# EAGLE design mini system- 5 components vertical (EAGLE 9.2.2)
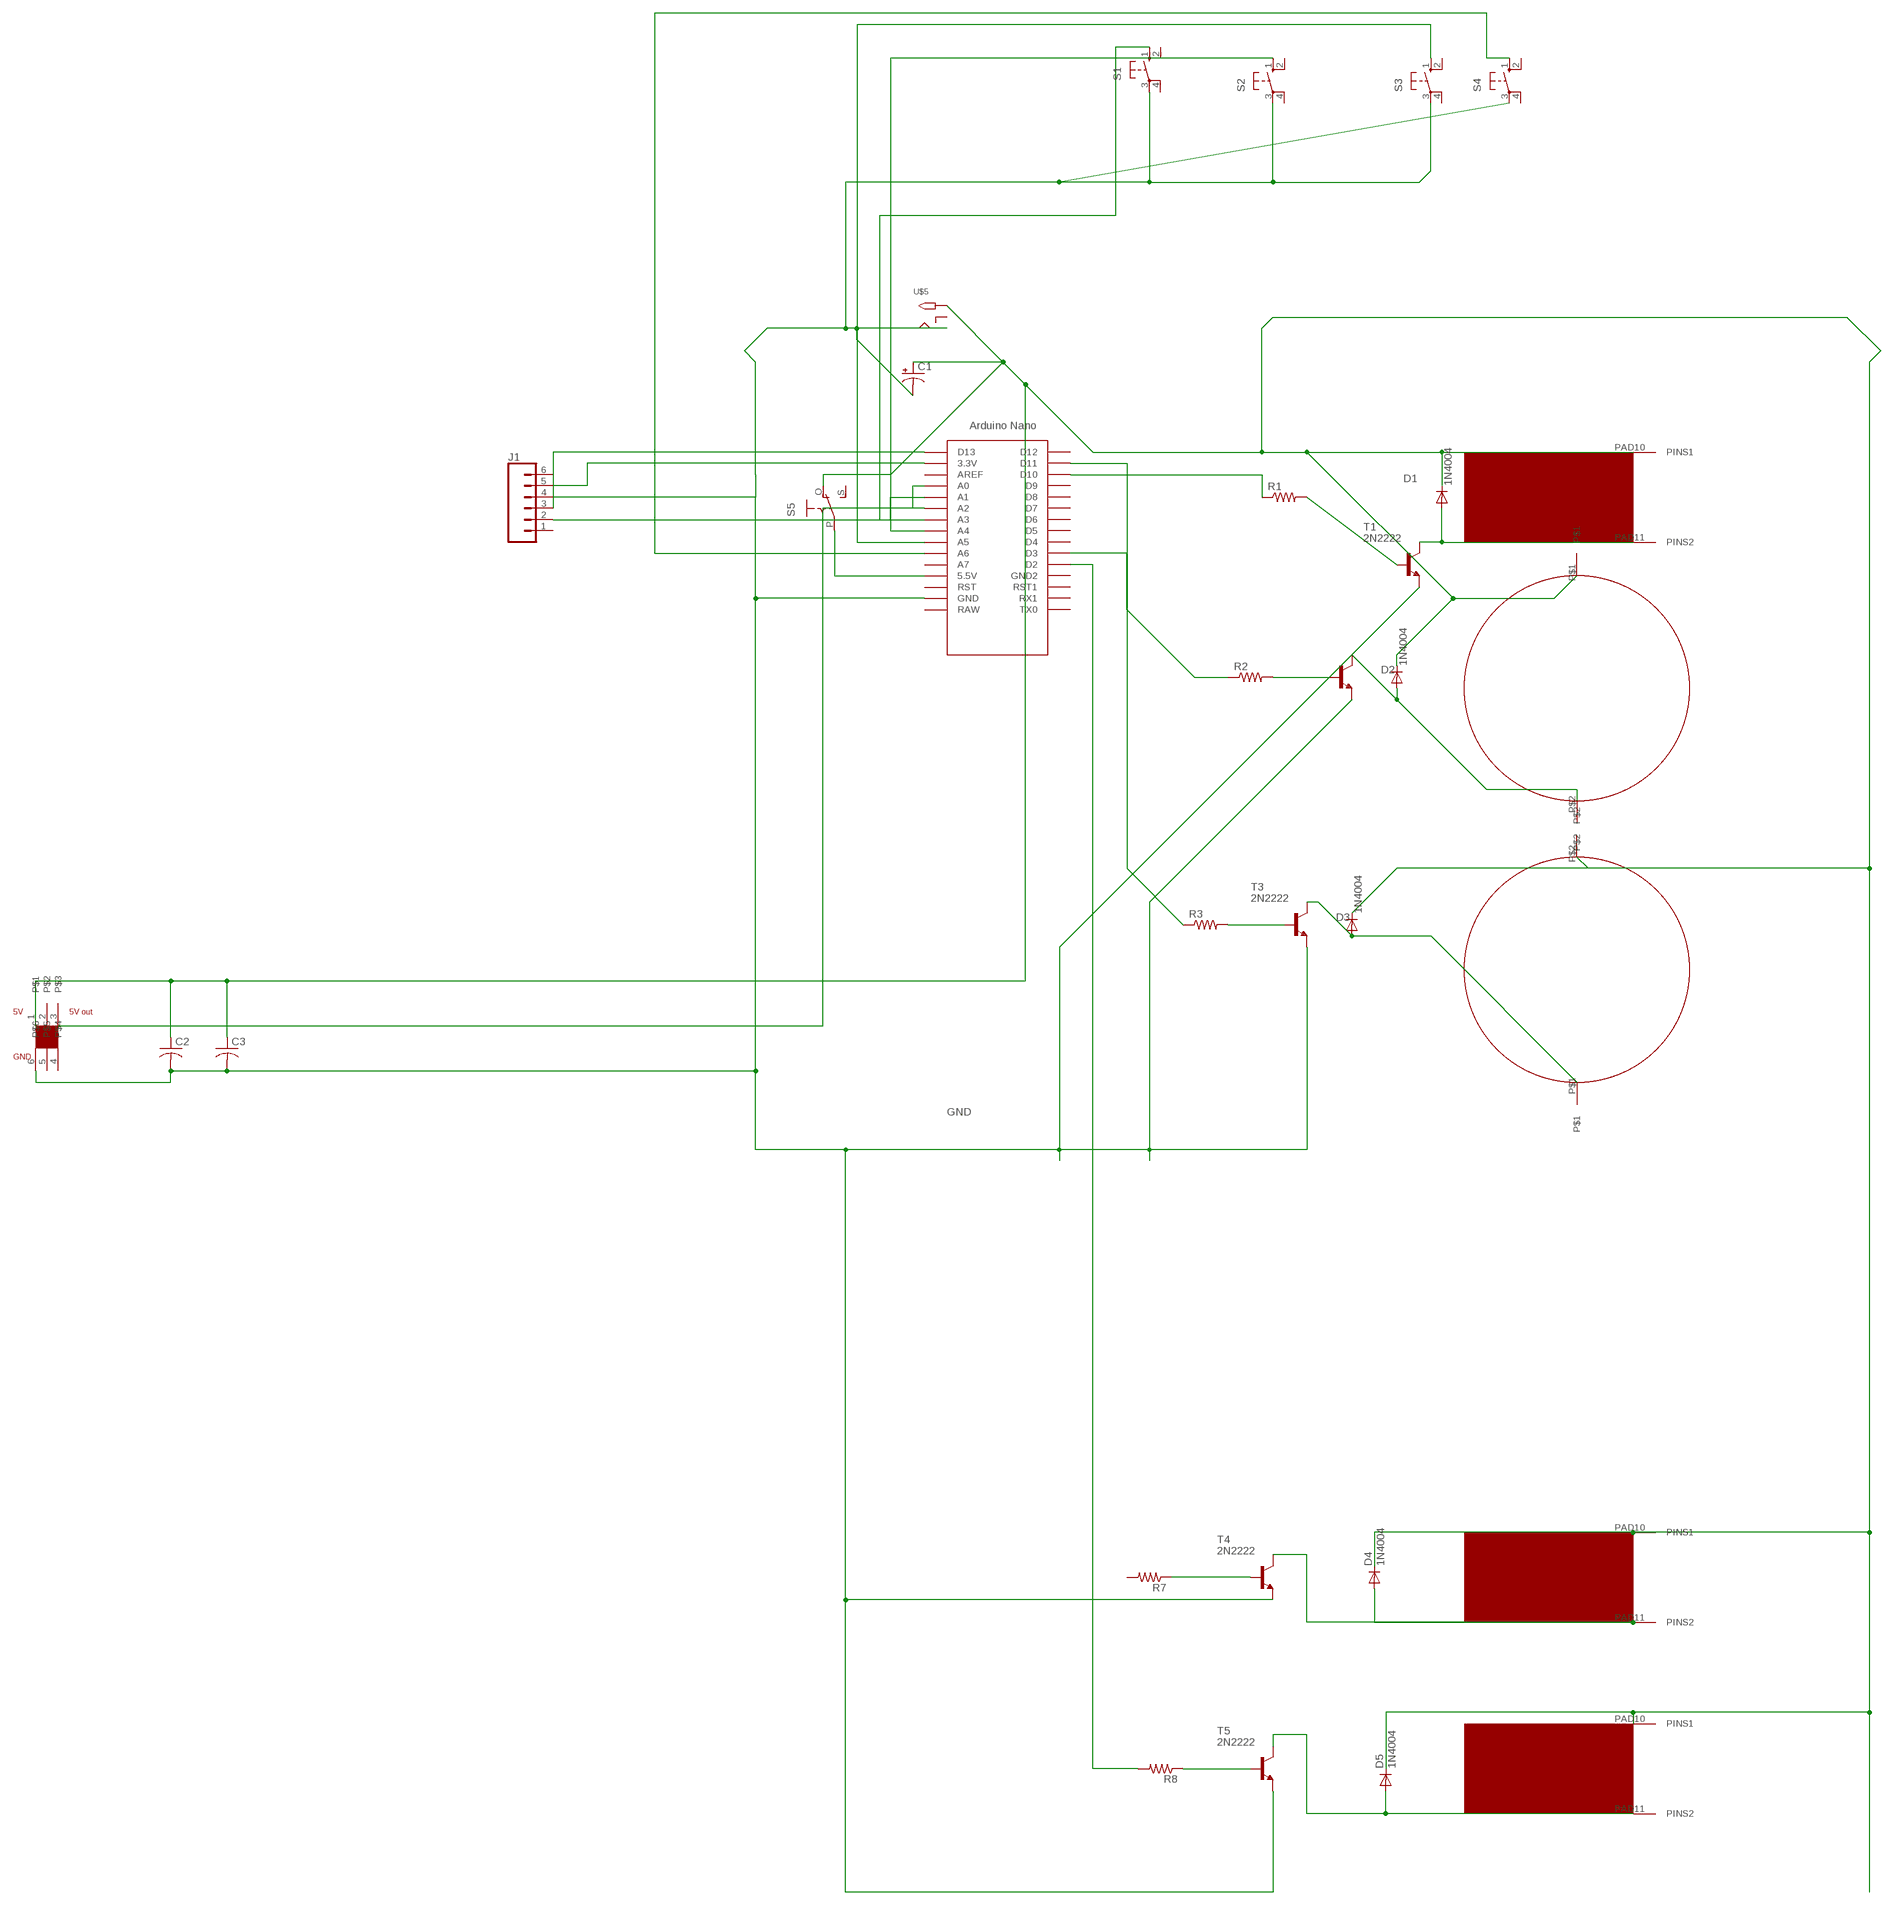
[diagram p0: schematic, sheet 1]

## Parts
C1  CPOL-USE2.5-5  [E2,5-5]
C2  C-US025-024X044  [C025-024X044]
C3  C-US025-024X044  [C025-024X044]
D1  1N4004  [DO41-10]
D2  1N4004  [DO41-10]
D3  1N4004  [DO41-10]
D4  1N4004  [DO41-10]
D5  1N4004  [DO41-10]
J1  CONN_06SILK_FEMALE_PTH  [1X06]
PUMP1  DCPUMP  [PUMP]
R1  R-US_0207/10  [0207/10]
R2  R-US_0207/10  [0207/10]
R3  R-US_0207/10  [0207/10]
R7  R-US_0207/10  [0207/10]
R8  R-US_0207/10  [0207/10]
S1  10-XX  [B3F-10XX]
S2  10-XX  [B3F-10XX]
S3  10-XX  [B3F-10XX]
S4  10-XX  [B3F-10XX]
S5  EG1218S  [EG1218]
T1  2N2222  [TO92-EBC-OVAL]
T2  2N2222  [TO92-EBC-OVAL]
T3  2N2222  [TO92-EBC-OVAL]
T4  2N2222  [TO92-EBC-OVAL]
T5  2N2222  [TO92-EBC-OVAL]
U$1  NANO  [NANO]
U$2  VALVE  [VALVTEST2]
U$3  VALVE  [VALVTEST2]
U$4  DCPUMP  [PUMP]
U$5  2.1MMJACKTHM  [PJ-102A]
U$6  VALVE  [VALVTEST2]
U$7  ADP5101  [DIP750W53P254L720H850Q6B]

## Nets
5V: C1.+ C2.1 C3.1 D1.C D2.C D3.C D4.C D5.C PUMP1.P$1 S5.O U$2.PAD10(PINS1) U$3.PAD10(PINS1) U$4.P$2 U$5.TIP U$6.PAD10(PINS1) U$7.1
GND: C1.- C2.2 C3.2 J1.4 S1.3(P) S2.3(P) S3.3(P) S4.3(P) T1.E T2.E T3.E T4.E T5.E U$1.GND U$5.RING U$7.6
N$1: R1.2 T1.B
N$2: R2.2 T2.B
N$3: R3.2 T3.B
N$4: R1.1 U$1.D10
N$5: D2.A PUMP1.P$2 T2.C
N$6: R3.1 U$1.D11
N$7: R2.1 U$1.D3
N$8: D1.A T1.C U$2.PAD11(PINS2)
N$9: D3.A T3.C U$4.P$1
N$10: R8.2 U$1.D2
N$11: S1.1(S) U$1.A3
N$12: J1.5 U$1.3.3V
N$13: U$1.A0
N$14: S5.P U$1.5V(5.5V)
N$15: J1.2 U$1.A1
N$16: D4.A T4.C U$3.PAD11(PINS2)
N$17: R7.1 T4.B
N$20: R8.1 T5.B
N$21: D5.A T5.C U$6.PAD11(PINS2)
N$22: U$1.A2 U$7.3
N$23: S2.1(S) U$1.A4
N$24: S4.1(S) U$1.A6
N$25: S3.1(S) U$1.A5
N$26: J1.3 U$1.D13
Unconnected: J1.1 J1.6 R7.2 S1.2(S1) S1.4(P1) S2.2(S1) S2.4(P1) S3.2(S1) S3.4(P1) S4.2(S1) S4.4(P1) S5.S U$1.A7 U$1.AREF U$1.D4 U$1.D5 U$1.D6 U$1.D7 U$1.D8 U$1.D9 U$1.D12 U$1.GND1(GND2) U$1.RAW U$1.RST U$1.RST1 U$1.RX1 U$1.TX0 U$5.RING_SW U$7.2 U$7.4 U$7.5

## Library data of the parts
C1 = adafruit:CPOL-US: POLARIZED CAPACITOR, American symbol
C2 C3 = rcl:C-US: CAPACITOR, American symbol; SPICEPREFIX: C
D1-D5 = adafruit:1N4004: DIODE General purpose 1N400x type rectifier (With bigger pads) http://www.ladyada.net/library/pcb/eaglelibrary.html
J1 = SparkFun-Connectors:CONN_06: Multi connection point. Often used as Generic Header-pin footprint for 0.1 inch spaced/style header connections On any of the 0.1 inch spaced packages, you can populate with these: Break Away Headers - Straight <https://www.sparkfun.com/products/116> (PRT-00116) Break Away Male Headers - Right Angle <https://www.sparkfun.com/products/553> (PRT-00553) Female Headers <https://www.sparkfun.com/products/115> (PRT-00115) Break Away Headers - Machine Pin <https://www.sparkfun.com/products/117> (PRT-00117) Break Away Female Headers - Swiss Machine Pin <https://www.sparkfun.com/products/743> (PRT-00743) Arduino Stackable Header - 6 Pin <https://www.sparkfun.com/products/9280> (PRT-09280) For SCREWTERMINALS and SPRING TERMINALS visit here: Screw Terimnals on SparkFun.com <https://www.sparkfun.com/search/results?term=Screw+Terminals> (5mm/3.5mm/2.54mm spacing) This device is also useful as a general connection point to wire up your design to another part of your project. Our various solder wires solder well into these plated through hole pads. Hook-Up Wire - Assortment (Stranded, 22 AWG) <https://www.sparkfun.com/products/11375> (PRT-11375) Hook-Up Wire - Assortment (Solid Core, 22 AWG) <https://www.sparkfun.com/products/11367> (PRT-11367) View the entire wire category on our website here <https://www.sparkfun.com/categories/141>; PROD_ID: CONN-08437
PUMP1 U$4 = local eagle library:DCPUMP
R1-R3 R7 R8 = adafruit:R-US_: RESISTOR, American symbol
S1-S4 = switch-omron:10-XX: OMRON SWITCH; MPN: B3F-1000; OC_FARNELL: 176432; OC_NEWARK: 36M3542
S5 = adafruit:EG1218: SLIDING SWITCH 0.1" spacing through hole, vertical SPDT slide switch http://www.ladyada.net/library/pcb/eaglelibrary.html
T1-T5 = adafruit:2N2222: NPN TRANSISTOR Big oval pads
U$1 = Arduino-clone:NANO: Arduino Nano
U$2 U$3 U$6 = local eagle library:VALVE: pn eumatic valve
U$5 = adafruit:2.1MMJACK: 2.1mm x 5.5mm THM DC jack with internal switch. Digikey part #PJ-102A, 4UCON part #05537 2.1mm x 5.5mm SMT DC jack with internal switch. Digikey part #PJ-002A-SMT, 4UCON part #03267 By microbuilder.eu & adafruit.com
U$7 = local eagle library:ADP5101

## Board
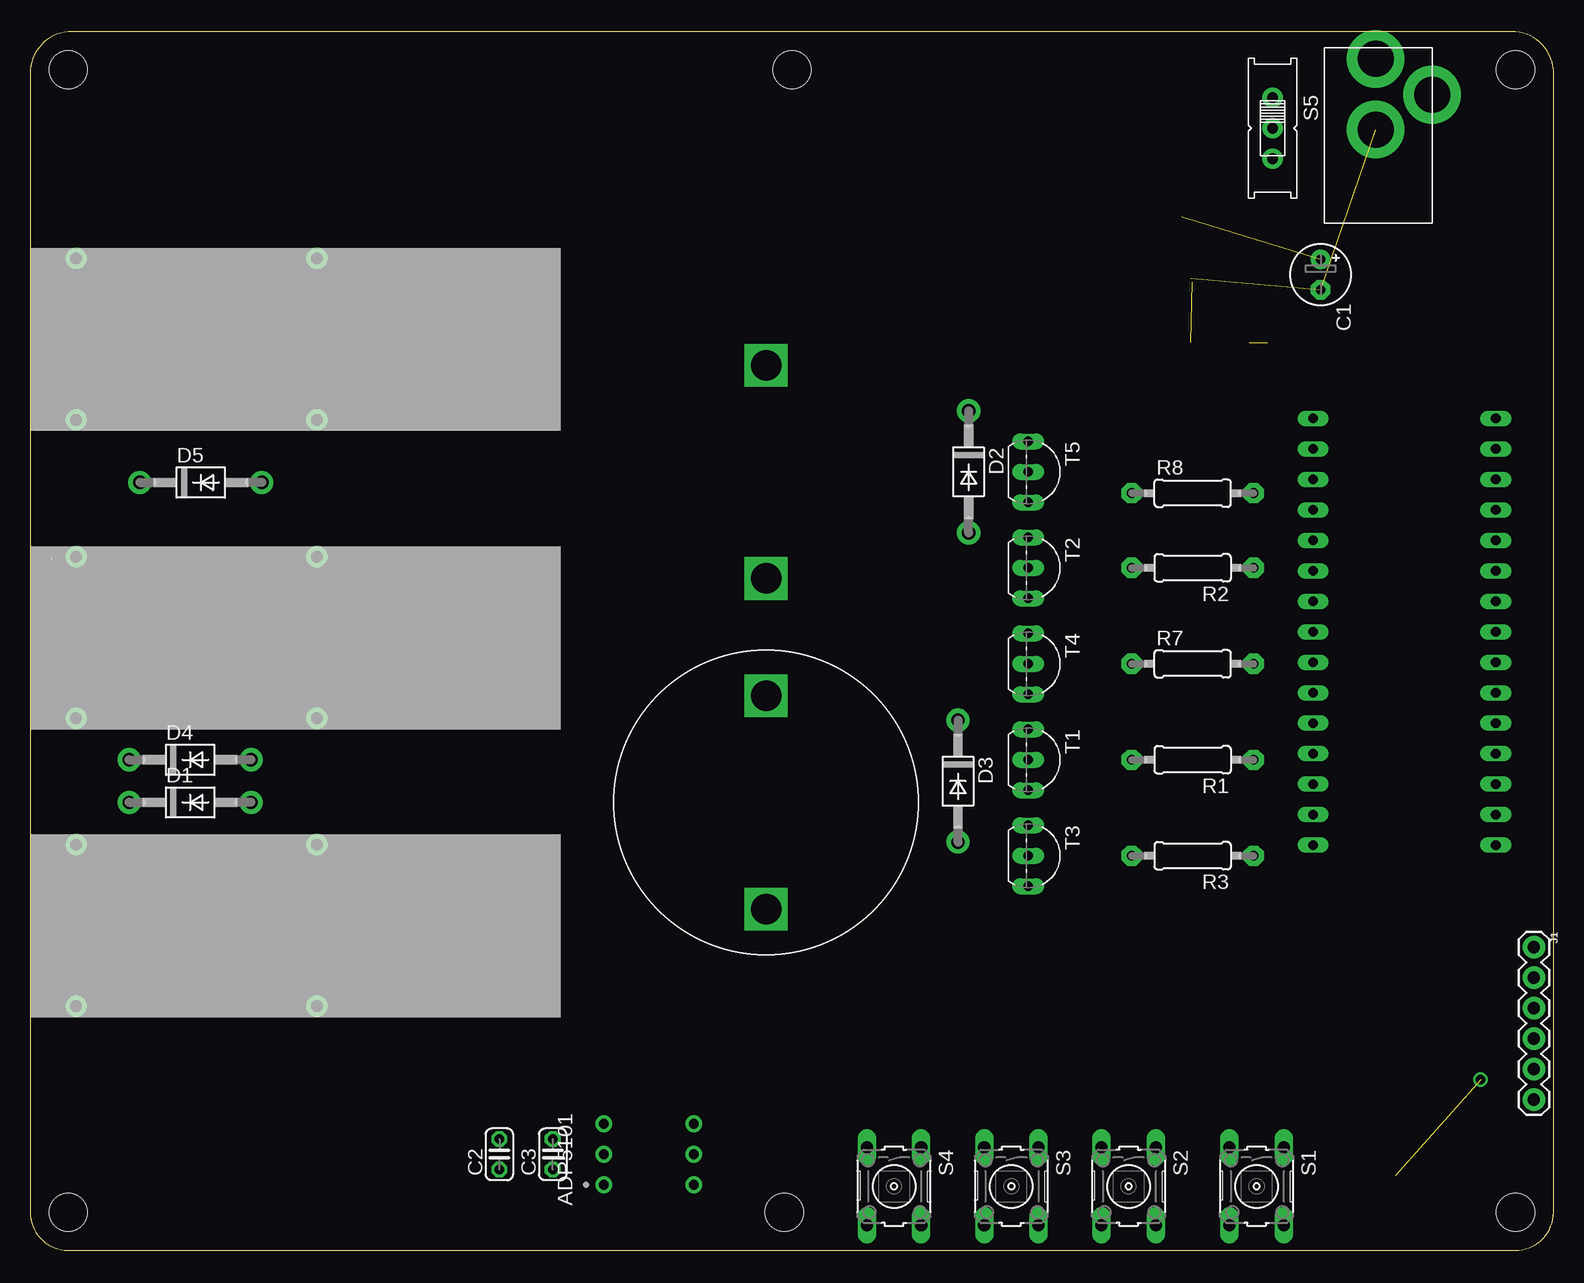
[diagram p1: board, top side]
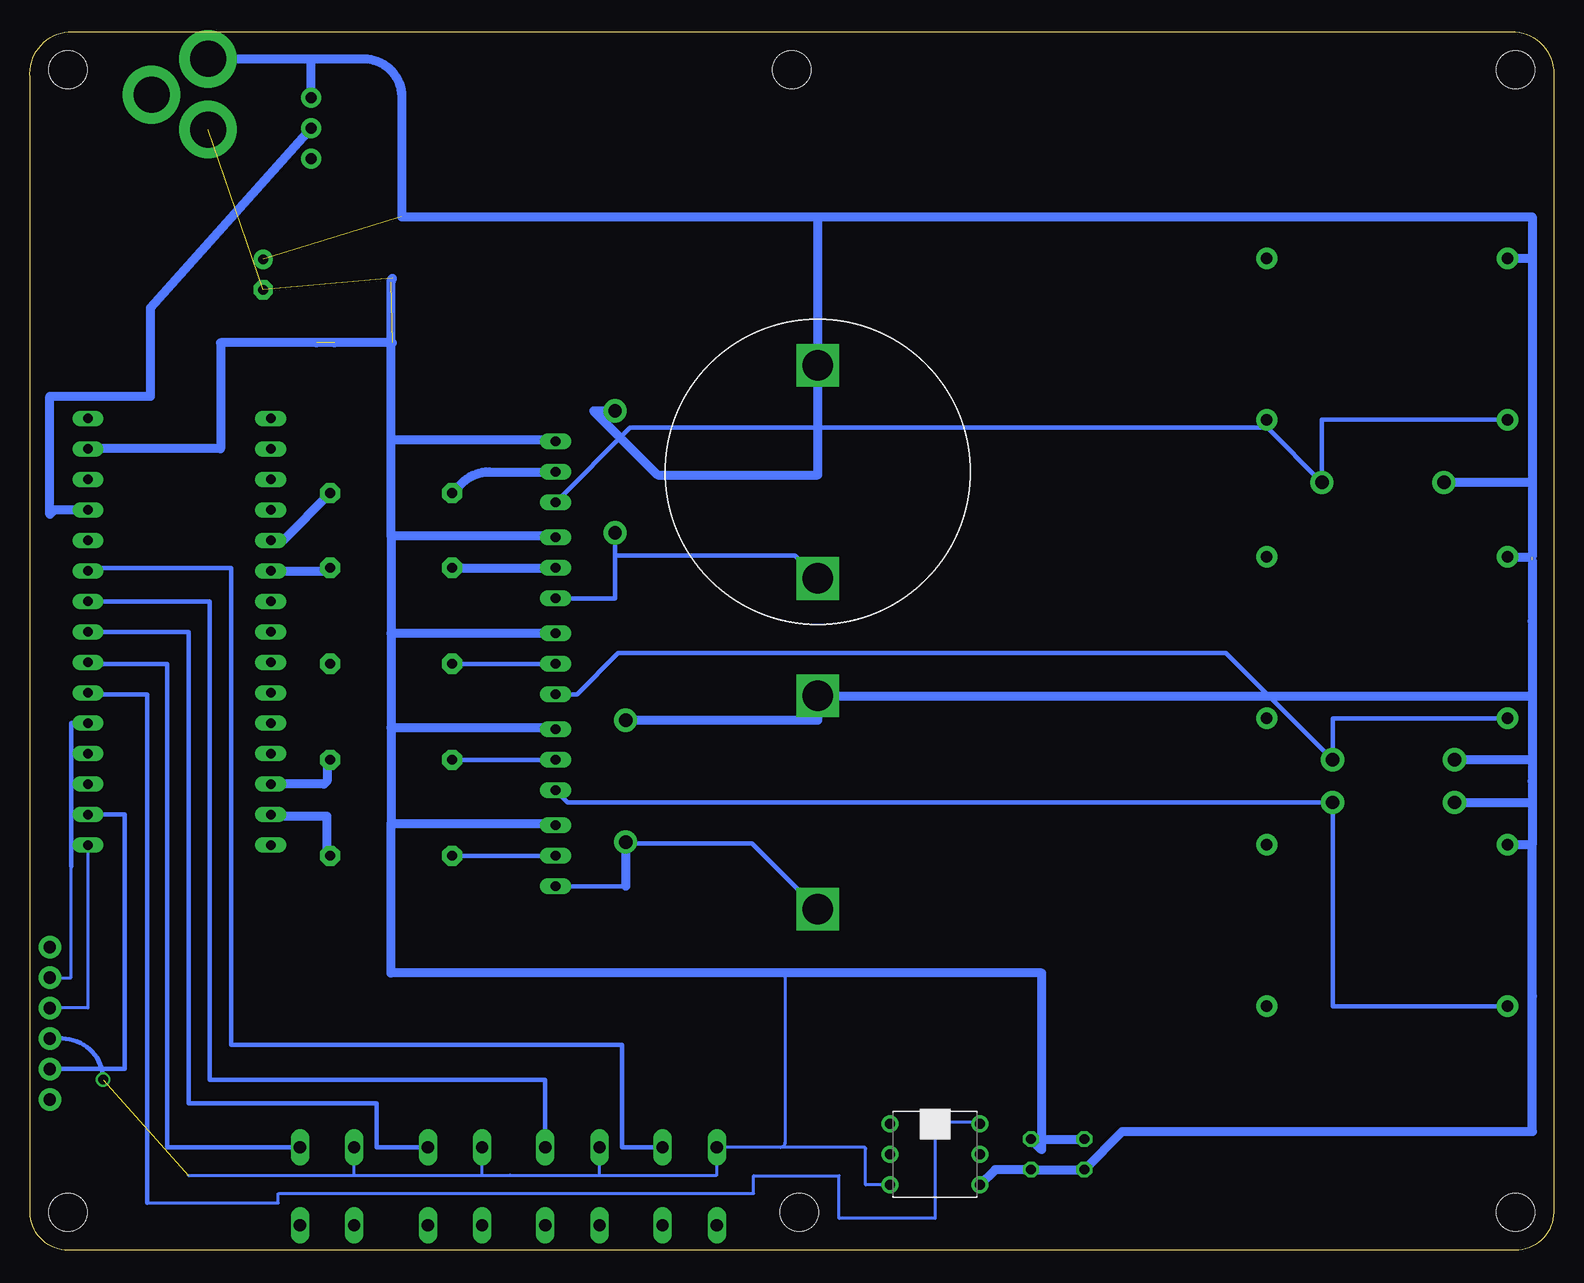
[diagram p2: board, bottom side, seen from below]

Size 127.02 x 101.59 mm. Coordinates in mm from the lower left corner, seen from the top.
Outline: 127,3.17 127,97.78 arc90 123.83,101.59 3.19,101.59 arc90 0.01,97.78 0.01,3.17 arc90 3.19,0 123.83,0 arc90 127,3.17
Copper layers (1*16): Top 0.035mm / dielectric 1.5mm / Bottom 0.035mm
Design rules "default *": minimum track width 6mil, minimum drill 0.35mm, track to track 32mil, track to pad 32mil, pad to pad 6mil, via to via 6mil, smd to smd 6mil, copper to edge 40mil, drill to drill 6mil, minimum pad ring 10mil, minimum via ring 8mil, stop-mask expansion 4mil, vias tented up to drill 0mil, thermal gap 10mil
Holes 3.17 mm at 3.19,98.42 3.19,3.17 123.84,3.17 123.84,98.42 63.51,98.42 62.88,3.17

### Footprints (pad centres in the part's own frame; a part is rotated, then mirrored left to right if it is on the bottom)
E2,5-5 = drill 0.813 pad 1.6: + -1.27,0 | drill 0.813 pad 1.6 octagon: - 1.27,0
C025-024X044 = drill 0.813 octagon: 1 -1.27,0; 2 1.27,0
DO41-10 = drill 1.118 pad 1.93: A 5.08,0; C -5.08,0
1X06 = drill 1.016 pad 1.88: 1 0,0; 2 2.54,0; 3 5.08,0; 4 7.62,0; 5 10.16,0; 6 12.7,0
PUMP = drill 2.54 square: P$1 -8.89,0; P$2 8.89,0
0207/10 = drill 0.813 pad 1.676 octagon: 1 -5.08,0; 2 5.08,0
B3F-10XX = drill 1.016 long: 1 -3.251,2.261; 2 3.251,2.261; 3 -3.251,-2.261; 4 3.251,-2.261
EG1218 = drill 0.9 pad 1.676: O -2.54,0; P 0,0; S 2.54,0
TO92-EBC-OVAL = drill 0.813 long: B 0,-1.27; C 2.54,-1.27; E -2.54,-1.27
NANO = drill 0.8 long: 3.3V -10.16,24.13; 5V -10.16,-1.27; A0 -10.16,19.05; A1 -10.16,16.51; A2 -10.16,13.97; A3 -10.16,11.43; A4 -10.16,8.89; A5 -10.16,6.35; A6 -10.16,3.81; A7 -10.16,1.27; AREF -10.16,21.59; D2 5.08,1.27; D3 5.08,3.81; D4 5.08,6.35; D5 5.08,8.89; D6 5.08,11.43; D7 5.08,13.97; D8 5.08,16.51; D9 5.08,19.05; D10 5.08,21.59; D11 5.08,24.13; D12 5.08,26.67; D13 -10.16,26.67; GND -10.16,-6.35; GND1 5.08,-1.27; RAW -10.16,-8.89; RST -10.16,-3.81; RST1 5.08,-3.81; RX1 5.08,-6.35; TX0 5.08,-8.89
VALVTEST2 = drill 0.965 pad 1.778: PAD10 3.835,-0.864; PAD11 3.835,-14.326; PAD12 23.901,-14.326; PAD13 23.901,-0.864
PJ-102A = drill 3 pad 4.8: RING 0.1,-3.39; RING_SW -4.6,-6.29; TIP 0.1,-9.29
DIP750W53P254L720H850Q6B = drill 0.813 pad 1.397: 1 -2.54,3.75; 2 0,3.75; 3 2.54,3.75; 4 2.54,-3.75; 5 0,-3.75; 6 -2.54,-3.75

### Placement (x,y rotation side)
C1  107.58,81.34 270 top
C2  39.13,8 90 top
C3  43.58,8 90 top
D1  13.35,37.34 0 top
D2  78.25,64.9 270 top
D3  77.36,39.12 270 top
D4  13.35,40.89 0 top
D5  14.24,64.01 0 top
J1  125.36,25.27 270 top
PUMP1  61.36,64.9 270 bottom
R1  96.92,40.89 180 top
R2  96.92,56.9 180 top
R3  96.92,32.89 180 top
R7  96.92,48.9 0 top
R8  96.92,63.12 0 top
S1  102.25,5.33 270 top
S2  91.58,5.33 270 top
S3  81.8,5.33 270 top
S4  72.02,5.33 270 top
S5  103.58,93.54 270 top
T1  84.47,40.89 270 top
T2  84.47,56.9 270 top
T3  84.47,32.89 270 top
T4  84.47,48.9 270 top
T5  84.47,64.9 270 top
U$1  112.03,60.45 180 top
U$2  0.01,34.67 0 top
U$3  0.01,58.67 0 top
U$4  61.36,37.34 90 top
U$5  112.28,90.04 180 top
U$6  0.01,83.57 0 top
U$7  51.58,8 90 top

### Tracks (layer width: path | path; a pad name or v marks a point on that pad's centre or on a via)
5V  (2 unrouted)
  Bottom 0.762: 61.36,86.17 96.03,86.17 96.03,96.16 arc-90 99.2,99.33 103.58,99.33 | 61.36,86.17 PUMP1.P$1 61.36,64.64 74.69,64.64 80.02,69.98 D2.C | U$6.PAD10 1.79,82.7 | 1.79,82.7 1.79,64.01 | 1.79,52.45 1.79,40.89 | 1.79,40.89 1.79,39.12 | 1.79,40.89 D4.C | 1.79,64.01 1.79,57.81 U$3.PAD10 | 1.79,57.53 1.79,52.45 | 1.79,52.45 1.79,46.23 U$4.P$2 61.36,44.2 D3.C | 1.79,64.01 D5.C | 1.79,52.45 | 1.79,39.12 arc-45 1.79,39.12 | 1.79,39.12 1.79,37.34 | 1.79,37.34 1.79,33.78 | 1.79,33.78 3.79,33.78 arc45 U$2.PAD10 | D1.C 1.79,37.34 | 1.79,33.78 1.79,21.23 1.77,21.21 1.77,9.91 35.96,9.91 C2.1 C3.1 46.56,6.73 U$7.1 | U$5.TIP 103.58,99.33 | 61.36,86.17 1.79,86.17 1.79,82.7 | S5.O 103.58,99.33
GND  (5 unrouted)
  Bottom 0.254: 64.47,8.59 S4.3 69.8,6.22 79.58,6.22 | 79.58,6.22 86.9,6.22 | 86.9,6.22 arc45 87,6.26 | 86.9,6.22 89.36,6.22 | 89.36,6.22 100.03,6.22 | 100.03,6.22 113.81,6.22 | S1.3 100.03,6.22 | S2.3 89.36,6.22 | S3.3 79.58,6.22 | 64.47,8.59 57.49,8.59 arc90 57.35,8.45 57.35,5.46 U$7.6 | 64.09,23.11 64.09,8.96 arc90 64.47,8.59
  Bottom 0.381: 122.16,66.83 U$1.GND | J1.4 124.35,17.65 arc90 120.92,14.22
  Bottom 0.762: 96.79,75.67 103.14,75.67 | 101.63,75.67 111.14,75.67 111.14,66.83 122.16,66.83 | T4.E 96.92,51.44 | 96.92,51.44 96.92,43.56 | 96.92,43.56 96.92,35.56 | 96.92,35.56 96.92,23.11 64.09,23.11 42.69,23.11 42.69,8.38 C3.2 C2.2 | T3.E arc-45 83.51,35.56 96.92,35.56 | T1.E arc-45 83.51,43.56 96.92,43.56 | T2.E arc-45 83.51,59.56 96.92,59.56 | 96.79,81.03 arc-45 96.92,80.72 96.92,67.56 | 96.92,59.56 96.92,67.56 | T5.E arc-90 83.33,67.56 96.92,67.56 | 96.92,59.56 96.92,51.44
N$1
  Bottom 0.381: R1.2 T1.B
N$2
  Bottom 0.762: R2.2 | R2.2 T2.B
N$3
  Bottom 0.381: R3.2 T3.B
N$4
  Bottom 0.762: R1.1 102.25,40.64 102.25,39.12 102.5,38.86 U$1.D10
N$5
  Bottom 0.381: T2.C 78.25,54.36 78.25,57.91 | 78.25,57.91 63.26,57.91 PUMP1.P$2 | D2.A 78.25,57.91
N$6
  Bottom 0.762: R3.1 102.25,33.15 102.25,36.2 106.82,36.2 U$1.D11
N$7
  Bottom 0.762: U$1.D3 102.25,56.64 R2.1
N$8
  Bottom 0.381: T1.C 82.18,37.34 D1.A 18.43,20.34 U$2.PAD11
N$9
  Bottom 0.381: T3.C 77.36,30.35 | 77.36,33.91 66.82,33.91 U$4.P$1
  Bottom 0.762: D3.A 77.36,33.91 77.36,30.35
N$10
  Bottom 0.762: R8.2 105.93,59.18 U$1.D2
N$11
  Bottom 0.381: S1.1 115.58,8.59 115.58,48.9 122.19,48.9 U$1.A3
N$12
  Bottom 0.381: U$1.3.3V 119.14,36.32 119.14,15.11 J1.5
N$14
  Bottom 0.762: S5.P 116.98,78.55 116.98,71.19 125.36,71.19 125.36,61.34 124.98,61.72 U$1.5V
N$15
  Bottom 0.254: J1.2 123.59,22.73 123.59,32
  Bottom 0.381: 123.59,32 123.59,43.94 U$1.A1
N$16
  Bottom 0.381: T4.C 81.42,46.35 77.99,49.78 27.32,49.78 D4.A 18.43,44.35 U$3.PAD11
N$17
  Bottom 0.381: R7.1 T4.B
N$18  (via drill 0.81)
  other vias: 120.92,14.22
N$20
  Bottom 0.762: R8.1 90.99,63.97 arc45 88.74,64.9 T5.B
N$21
  Bottom 0.381: T5.C 76.98,68.58 23.89,68.58 D5.A 19.32,69.24 U$6.PAD11
N$22
  Bottom 0.254: U$7.3 47.83,10.67 51.58,10.67 51.58,2.67 59.58,2.67 59.58,6.22 66.69,6.22 66.69,4.75 106.31,4.75 106.31,3.95 117.24,3.95
  Bottom 0.381: 117.24,3.95 117.24,46.35 122.19,46.35 U$1.A2
N$23
  Bottom 0.381: S2.1 98.12,8.59 98.12,12.24 113.81,12.24 113.81,51.56 U$1.A4
N$24
  Bottom 0.381: S4.1 77.67,8.59 77.67,17.13 110.25,17.13 110.25,56.9 122.19,56.9 U$1.A6
N$25
  Bottom 0.381: S3.1 84.06,14.22 112.03,14.22 112.03,54.1 U$1.A5
N$26
  Bottom 0.254: U$1.D13 122.19,20.19 J1.3